# Altium schematic sheet 04_LED.SchDoc
size A4; SheetNumber: 5; SheetTotal: 5
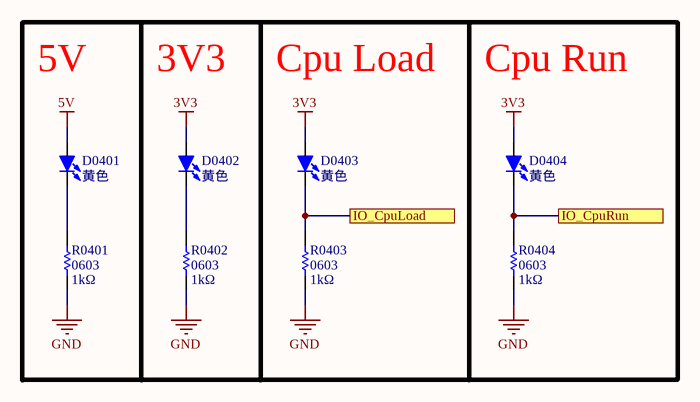
[diagram p0: 04_LED.SchDoc]

## Parts
D0401  黄色  [LED 0603Y]
D0402  黄色  [LED 0603Y]
D0403  黄色  [LED 0603Y]
D0404  黄色  [LED 0603Y]
R0401  Size: 0603  Res: 1kΩ  [R0402]  (hidden comment: RES)
R0402  Size: 0603  Res: 1kΩ  [R0402]  (hidden comment: RES)
R0403  Size: 0603  Res: 1kΩ  [R0402]  (hidden comment: RES)
R0404  Size: 0603  Res: 1kΩ  [R0402]  (hidden comment: RES)

## Blocks framed on the sheet
5V: D0401 R0401
3V3: D0402 R0402
Cpu Load: D0403 R0403
Cpu Run: D0404 R0404

## Ports
IO_CpuLoad (see 00_McuComBrd[3A]), IO_CpuRun (see 00_McuComBrd[3A])

## Nets
3V3: D0402.A D0403.A D0404.A
5V: D0401.A
GND: R0401.1 R0402.1 R0403.1 R0404.1
IO_CpuLoad: D0403.K R0403.2 ; port IO_CpuLoad
IO_CpuRun: D0404.K R0404.2 ; port IO_CpuRun
NetD0401_K: D0401.K R0401.2
NetD0402_K: D0402.K R0402.2

## Library data of the parts
D0401 D0402 D0403 D0404 = LED-SMD: 贴片LED; 版权归属: 源创客; BOM名称: 贴片LED; 学习资源: www.ooocke.com
R0401 R0402 R0403 R0404 = RES: 电阻; Current: 1A